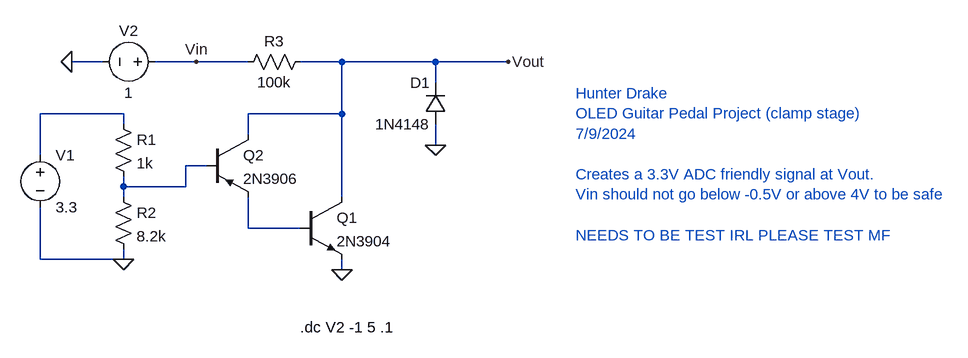
[diagram p0: schematic guitar_waveform_clamp_sim.asc]
guitar_waveform_clamp_sim.asc, the LTspice schematic file:
Version 4
SHEET 1 2320 1472
WIRE 96 0 48 0
WIRE 240 0 176 0
WIRE 320 0 240 0
WIRE 464 0 400 0
WIRE 608 0 464 0
WIRE 720 0 608 0
WIRE 608 32 608 0
WIRE 128 80 0 80
WIRE 464 80 464 0
WIRE 464 80 320 80
WIRE 128 96 128 80
WIRE 320 112 320 80
WIRE 608 128 608 96
WIRE 0 144 0 80
WIRE 256 160 224 160
WIRE 128 192 128 176
WIRE 224 192 224 160
WIRE 224 192 128 192
WIRE 128 208 128 192
WIRE 464 208 464 80
WIRE 320 256 320 208
WIRE 400 256 320 256
WIRE 0 304 0 224
WIRE 128 304 128 288
WIRE 128 304 0 304
WIRE 464 320 464 304
FLAG 128 304 0
FLAG 608 128 0
FLAG 464 320 0
FLAG 48 0 0
FLAG 720 0 Vout
FLAG 240 0 Vin
SYMBOL res 112 80 R0
SYMATTR InstName R1
SYMATTR Value 1k
SYMBOL res 112 192 R0
SYMATTR InstName R2
SYMATTR Value 8.2k
SYMBOL voltage 0 128 R0
SYMATTR InstName V1
SYMATTR Value 3.3
SYMBOL npn 400 208 R0
SYMATTR InstName Q1
SYMATTR Value 2N3904
SYMBOL pnp 256 112 R0
SYMATTR InstName Q2
SYMATTR Value 2N3906
SYMBOL diode 624 96 R180
WINDOW 0 24 64 Left 2
WINDOW 3 24 0 Left 2
SYMATTR InstName D1
SYMATTR Value 1N4148
SYMBOL voltage 192 0 R90
WINDOW 0 -32 56 VBottom 2
WINDOW 3 32 56 VTop 2
SYMATTR InstName V2
SYMATTR Value 1
SYMBOL res 416 -16 R90
WINDOW 0 0 56 VBottom 2
WINDOW 3 32 56 VTop 2
SYMATTR InstName R3
SYMATTR Value 100k
TEXT 400 408 Left 2 !.dc V2 -1 5 .1
TEXT 824 48 Left 2 ;Hunter Drake\nOLED Guitar Pedal Project (clamp stage)\n7/9/2024\n \nCreates a 3.3V ADC friendly signal at Vout.\nVin should not go below -0.5V or above 4V to be safe\n \nNEEDS TO BE TEST IRL PLEASE TEST MF

The netlist it stands for:
* guitar_waveform_clamp_sim.asc
R1 N001 N002 1k
R2 N002 0 8.2k
V1 N001 0 3.3
Q1 Vout N003 0 0 2N3904
Q2 Vout N002 N003 0 2N3906
D1 0 Vout 1N4148
V2 Vin 0 1
R3 Vout Vin 100k
.model D D
.lib standard.dio
.model NPN NPN
.model PNP PNP
.lib standard.bjt
.dc V2 -1 5 .1
* Hunter Drake
* OLED Guitar Pedal Project (clamp stage)
* 7/9/2024
* Creates a 3.3V ADC friendly signal at Vout.
* Vin should not go below -0.5V or above 4V to be safe
* NEEDS TO BE TEST IRL PLEASE TEST MF
.backanno
.end

* Results of the author's LTspice run, read from the files saved beside the schematic
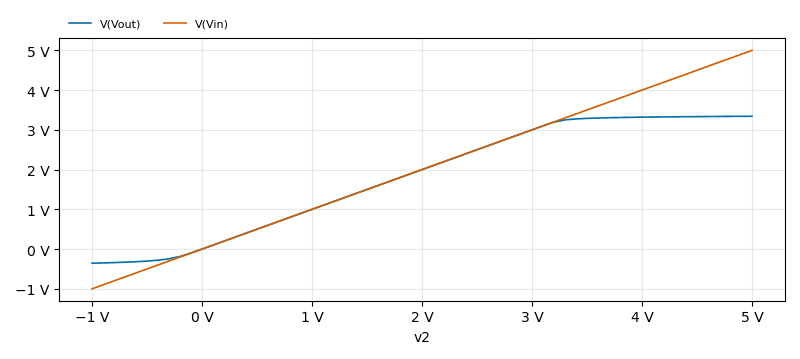
[diagram p1: DC transfer characteristic of guitar_waveform_clamp_sim.asc, plotted from the saved traces]
* DC transfer characteristic, 1 run:
*   V(Vout): -355.6 mV at v2=-1 V, 3.342 V at v2=5 V, min -355.6 mV, max 3.342 V
*   V(Vin): -1 V at v2=-1 V, 5 V at v2=5 V, min -1 V, max 5 V